# Altium schematic sheet 2228_Recepteur_MIKROE_NRF.SchDoc
size A4; Author: Miguel Santos; Organization: ETML-ES; Address1: Avenue Recordon 1; Address2: 1004 Lausanne; Address3: Switzerland; Revision: 1; SheetNumber: 3; SheetTotal: 3
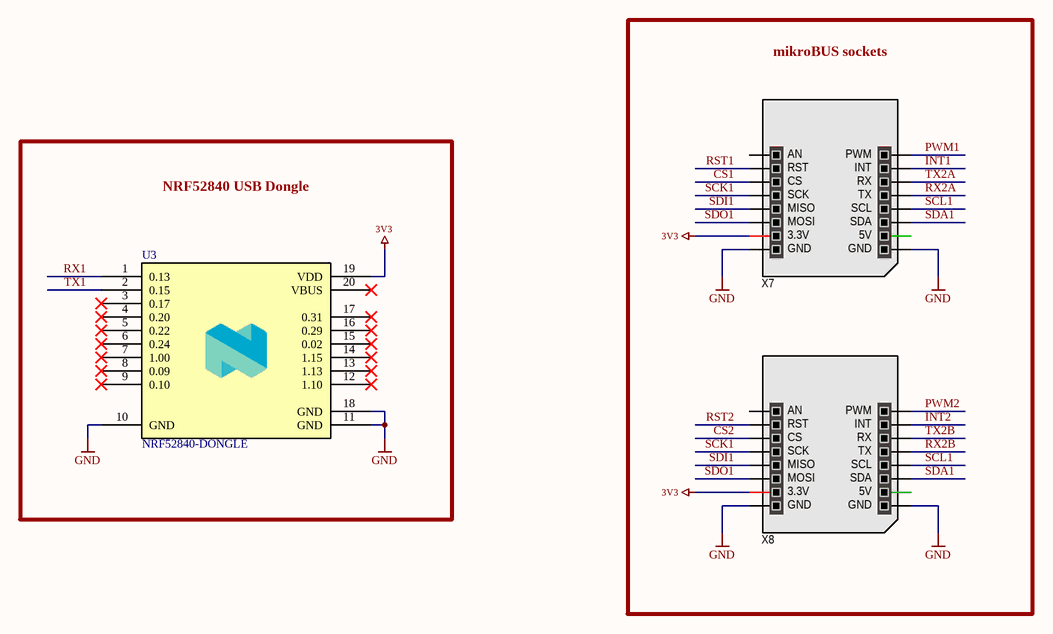
[diagram p0: 2228_Recepteur_MIKROE_NRF.SchDoc]

## Parts
U3  NRF52840-DONGLE  [NRF52840_DONGLE]
X7  MIKROBUS HOST CONN TH 16  [MIKROBUS HOST CONN. TH]  (value not drawn)
X8  MIKROBUS HOST CONN TH 16  [MIKROBUS HOST CONN. TH]  (value not drawn)

## Blocks framed on the sheet
mikroBUS sockets: X7 X8
NRF52840 USB Dongle: U3

## Nets
3V3: U3.19(VDD) X7.7(3.3V) X8.7(3.3V)
GND: U3.10(GND) U3.11(GND) U3.18(GND) X7.8(GND) X7.9(GND) X8.8(GND) X8.9(GND)
CS1: X7.3(CS)
CS2: X8.3(CS)
INT1: X7.15(INT)
INT2: X8.15(INT)
PWM1: X7.16(PWM)
PWM2: X8.16(PWM)
RST1: X7.2(RST)
RST2: X8.2(RST)
RX1: U3.1(0.13)
RX2A: X7.13(TX)
RX2B: X8.13(TX)
SCK1: X7.4(SCK) X8.4(SCK)
SCL1: X7.12(SCL) X8.12(SCL)
SDA1: X7.11(SDA) X8.11(SDA)
SDI1: X7.5(MISO) X8.5(MISO)
SDO1: X7.6(MOSI) X8.6(MOSI)
TX1: U3.2(0.15)
TX2A: X7.14(RX)
TX2B: X8.14(RX)

Not connected (* = marked no-connect by the designer): U3 3(0.17)* 4(0.20)* 5(0.22)* 6(0.24)* 7(1.00)* 8(0.09)* 9(0.10)* 12(1.10)* 13(1.13)* 14(1.15)* 15(0.02)* 16(0.29)* 17(0.31)* 20(VBUS)*; X7 1(AN) 10(5V); X8 1(AN) 10(5V)

## Notes on the sheet
- Fichier :
- a
- Date :
- Heure :
- Version :
- Auteur :
- Modif.
- b
- c
- d
- Projet :
- No :
- Nb feuilles
- Feuille n°
- Chemin :

## Library data of the parts
U3 = NRF52840-DONGLE: Manufacturer: Nordic Semiconductor; Manufacturer_Number: NRF52840-DONGLE
X7 X8 = MIKROBUS HOST CONN